# Altium schematic sheet Ethernet SD IO.SchDoc: Ethernet, SD, IO
size A4; Organization: Gadget Sandbox; SheetNumber: 4; SheetTotal: 5; License: CC-BY-SA 3.0; Version: 0.1; Project: NeoCortex Alice
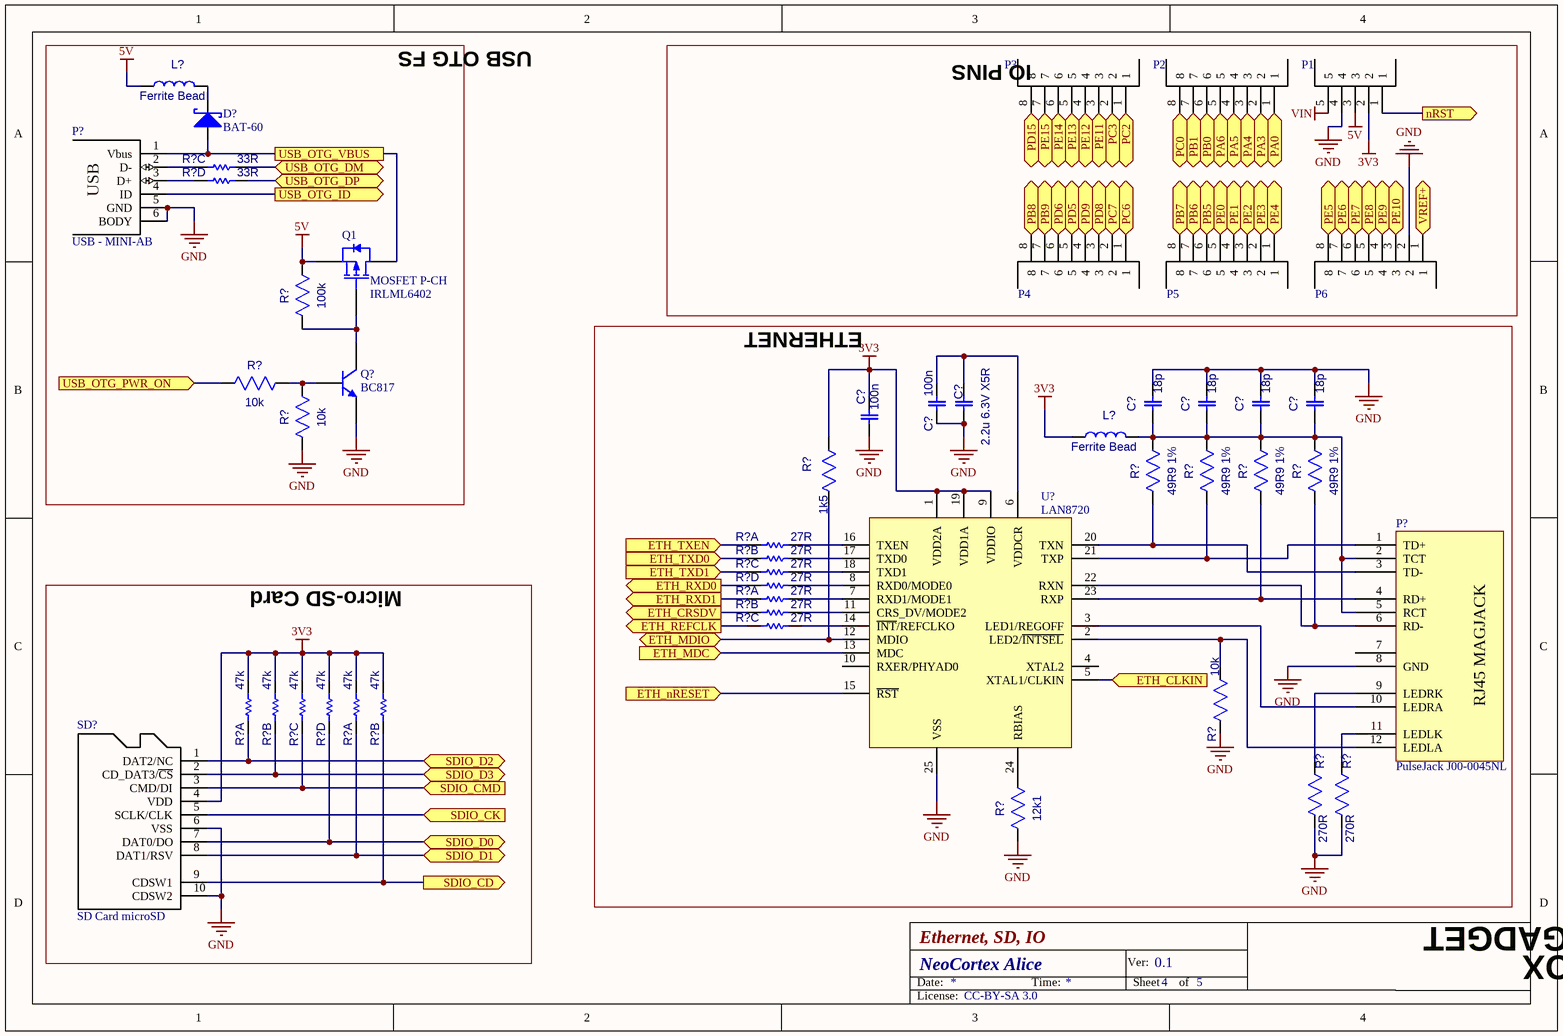
[diagram p0: Ethernet SD IO.SchDoc]

## Parts
(Parts that share a designator on the sheet are numbered #1, #2 ... from top to bottom, then left to right.)
C?#1  2.2u 6.3V X5R  [CAP 0603]
C?#2  100n  [CAP 0805]
C?#3  18p  [CAP 0603]
C?#4  18p  [CAP 0603]
C?#5  18p  [CAP 0603]
C?#6  18p  [CAP 0603]
C?#7  100n  [CAP 0603]
D?  BAT-60  [SOD-323]
L?#1  Ferrite Bead  [IND 0603]
L?#2  Ferrite Bead  [IND 0603]
P1  CONN - 5W  [Header Female 05 2.54]  (value not drawn)
P2  CONN - 8W  [TERM-PL-8 3.81]  (value not drawn)
P3  CONN - 8W  [TERM-PL-8 3.81]  (value not drawn)
P4  CONN - 8W  [TERM-PL-8 3.81]  (value not drawn)
P5  CONN - 8W  [TERM-PL-8 3.81]  (value not drawn)
P6  CONN - 8W  [TERM-PL-8 3.81]  (value not drawn)
P?#1  USB - MINI-AB  [USB - MINI-AB SMD]
P?#2  PulseJack J00-0045NL  [RJ45 MAGJACK STARJACK]
Q1  MOSFET P-CH  Comp2: IRLML6402  [SOT-23]
Q?  BC817  [SOT-23]
R?#1  33R  [RES ARRAY 0804]  (part C of 4)
R?#2  33R  [RES ARRAY 0804]  (part D of 4)
R?#3  100k  [RES 0603]
R?#4  10k  [RES 0603]
R?#5  10k  [RES 0603]
R?#6  1k5  [RES 0603]
R?#7  49R9 1%  [RES 0603]
R?#8  49R9 1%  [RES 0603]
R?#9  49R9 1%  [RES 0603]
R?#10  49R9 1%  [RES 0603]
R?#11  27R  [RES ARRAY 0804]  (part A of 4)
R?#12  27R  [RES ARRAY 0804]  (part B of 4)
R?#13  27R  [RES ARRAY 0804]  (part C of 4)
R?#14  27R  [RES ARRAY 0804]  (part D of 4)
R?#15  27R  [RES ARRAY 0804]  (part A of 4)
R?#16  27R  [RES ARRAY 0804]  (part B of 4)
R?#17  27R  [RES ARRAY 0804]  (part C of 4)
R?#18  47k  [RES ARRAY 0804]  (part A of 4)
R?#19  47k  [RES ARRAY 0804]  (part B of 4)
R?#20  47k  [RES ARRAY 0804]  (part C of 4)
R?#21  47k  [RES ARRAY 0804]  (part D of 4)
R?#22  47k  [RES ARRAY 0804]  (part A of 4)
R?#23  47k  [RES ARRAY 0804]  (part B of 4)
R?#24  10k  [RES 0603]
R?#25  270R  [RES 0603]
R?#26  270R  [RES 0603]
R?#27  12k1  [RES 0603]
SD?  SD Card microSD  [SD CARD microSD 3]
U?  LAN8720  [QFN-24 (4x4)]

## Blocks framed on the sheet
USB OTG FS: D? L?#1 P?#1 Q1 Q? R?#1-R?#5
IO PINS: P1-P6
ETHERNET: C?#1-C?#7 L?#2 P?#2 R?#6-R?#17 R?#24-R?#27 U?
Micro-SD Card: R?#18-R?#23 SD?

## Ports
ETH_CLKIN (in), ETH_CRSDV (out), ETH_MDC (in), ETH_MDIO (bidir), ETH_nRESET (in), ETH_REFCLK (out), ETH_RXD0 (out), ETH_RXD1 (out), ETH_TXD0 (in), ETH_TXD1 (in), ETH_TXEN (in), nRST (out), PA0 (bidir), PA3 (bidir), PA4 (bidir), PA5 (bidir), PA6 (bidir), PB0 (bidir), PB1 (bidir), PB5 (bidir), PB6 (bidir), PB7 (bidir), PB8 (bidir), PB9 (bidir), PC0 (bidir), PC2 (bidir), PC3 (bidir), PC6 (bidir), PC7 (bidir), PD5 (bidir), PD6 (bidir), PD8 (bidir), PD9 (bidir), PD15 (bidir), PE0 (bidir), PE1 (bidir), PE2 (bidir), PE3 (bidir), PE4 (bidir), PE5 (bidir), PE6 (bidir), PE7 (bidir), PE8 (bidir), PE9 (bidir), PE10 (bidir), PE11 (bidir), PE12 (bidir), PE13 (bidir), PE14 (bidir), PE15 (bidir), SDIO_CD (out), SDIO_CK (in), SDIO_CMD (in), SDIO_D0 (bidir), SDIO_D1 (bidir), SDIO_D2 (bidir), SDIO_D3 (bidir), USB_OTG_DM (bidir), USB_OTG_DP (bidir), USB_OTG_ID (out), USB_OTG_PWR_ON (in), USB_OTG_VBUS, VREF+ (bidir)

## Nets
3V3: C?#7.2 L?#2.1 P1.2 R?#6.1 R?#18.8 R?#19.7 R?#20.6 R?#21.5 R?#22.8 R?#23.7 SD?.4(VDD) U?.1(VDD2A) U?.9(VDDIO) U?.19(VDD1A)
5V: L?#1.1 P1.3 Q1.2(S) R?#3.1
GND: C?#1.2 C?#2.1 C?#3.2 C?#4.2 C?#5.2 C?#6.2 C?#7.1 P1.4 P6.2 P?#1.5(GND) P?#1.6(BODY) P?#2.8(GND) Q?.2(E) R?#5.2 R?#24.2 R?#25.2 R?#26.2 R?#27.2 SD?.6(VSS) SD?.10(CDSW2) U?.25(VSS)
VIN: P1.5
ETH_CLKIN: U?.5(XTAL1/CLKIN) ; port ETH_CLKIN
ETH_CRSDV: R?#16.2 ; port ETH_CRSDV
ETH_MDC: U?.13(MDC) ; port ETH_MDC
ETH_MDIO: R?#6.2 U?.12(MDIO) ; port ETH_MDIO
ETH_nRESET: U?.15(~{RST}) ; port ETH_nRESET
ETH_REFCLK: R?#17.3 ; port ETH_REFCLK
ETH_RXD0: R?#14.4 ; port ETH_RXD0
ETH_RXD1: R?#15.1 ; port ETH_RXD1
ETH_TXD0: R?#12.2 ; port ETH_TXD0
ETH_TXD1: R?#13.3 ; port ETH_TXD1
ETH_TXEN: R?#11.1 ; port ETH_TXEN
nRST: P1.1 ; port nRST
PA0: P2.1 ; port PA0
PA3: P2.2 ; port PA3
PA4: P2.3 ; port PA4
PA5: P2.4 ; port PA5
PA6: P2.5 ; port PA6
PB0: P2.6 ; port PB0
PB1: P2.7 ; port PB1
PB5: P5.6 ; port PB5
PB6: P5.7 ; port PB6
PB7: P5.8 ; port PB7
PB8: P4.8 ; port PB8
PB9: P4.7 ; port PB9
PC0: P2.8 ; port PC0
PC2: P3.1 ; port PC2
PC3: P3.2 ; port PC3
PC6: P4.1 ; port PC6
PC7: P4.2 ; port PC7
PD5: P4.5 ; port PD5
PD6: P4.6 ; port PD6
PD8: P4.3 ; port PD8
PD9: P4.4 ; port PD9
PD15: P3.8 ; port PD15
PE0: P5.5 ; port PE0
PE1: P5.4 ; port PE1
PE2: P5.3 ; port PE2
PE3: P5.2 ; port PE3
PE4: P5.1 ; port PE4
PE5: P6.8 ; port PE5
PE6: P6.7 ; port PE6
PE7: P6.6 ; port PE7
PE8: P6.5 ; port PE8
PE9: P6.4 ; port PE9
PE10: P6.3 ; port PE10
PE11: P3.3 ; port PE11
PE12: P3.4 ; port PE12
PE13: P3.5 ; port PE13
PE14: P3.6 ; port PE14
PE15: P3.7 ; port PE15
SDIO_CD: R?#23.2 SD?.9(CDSW1) ; port SDIO_CD
SDIO_CK: SD?.5(SCLK/CLK) ; port SDIO_CK
SDIO_CMD: R?#20.3 SD?.3(CMD/DI) ; port SDIO_CMD
SDIO_D0: R?#21.4 SD?.7(DAT0/DO) ; port SDIO_D0
SDIO_D1: R?#22.1 SD?.8(DAT1/RSV) ; port SDIO_D1
SDIO_D2: R?#18.1 SD?.1(DAT2/NC) ; port SDIO_D2
SDIO_D3: R?#19.2 SD?.2(CD_DAT3/~{CS}) ; port SDIO_D3
USB_OTG_DM: R?#1.6 ; port USB_OTG_DM
USB_OTG_DP: R?#2.5 ; port USB_OTG_DP
USB_OTG_ID: P?#1.4(ID) ; port USB_OTG_ID
USB_OTG_PWR_ON: R?#4.2 ; port USB_OTG_PWR_ON
USB_OTG_VBUS: D?.1(A) P?#1.1(Vbus) Q1.3(D) ; port USB_OTG_VBUS
VREF+: P6.1 ; port VREF+
NetC?#1_1: C?#1.1 C?#2.2 U?.6(VDDCR)
NetC?#3_1: C?#3.1 C?#4.1 C?#5.1 C?#6.1 L?#2.2 P?#2.2(TCT) P?#2.5(RCT) R?#7.1 R?#8.1 R?#9.1 R?#10.1
NetD?_2: D?.2(K) L?#1.2
NetP?#1_2: P?#1.2(D-) R?#1.3
NetP?#1_3: P?#1.3(D+) R?#2.4
NetP?#2_1: P?#2.1(TD+) R?#8.2 U?.21(TXP)
NetP?#2_3: P?#2.3(TD-) R?#7.2 U?.20(TXN)
NetP?#2_4: P?#2.4(RD+) R?#9.2 U?.23(RXP)
NetP?#2_6: P?#2.6(RD-) R?#10.2 U?.22(RXN)
NetP?#2_9: P?#2.9(LEDRK) R?#25.1
NetP?#2_10: P?#2.10(LEDRA) U?.3(LED1/REGOFF)
NetP?#2_11: P?#2.11(LEDLK) R?#26.1
NetP?#2_12: P?#2.12(LEDLA) R?#24.1 U?.2(LED2/~{INTSEL})
NetQ1_1: Q1.1(G) Q?.3(C) R?#3.2
NetQ?_1: Q?.1(B) R?#4.1 R?#5.1
NetR?#11_8: R?#11.8 U?.16(TXEN)
NetR?#12_7: R?#12.7 U?.17(TXD0)
NetR?#13_6: R?#13.6 U?.18(TXD1)
NetR?#14_5: R?#14.5 U?.8(RXD0/MODE0)
NetR?#15_8: R?#15.8 U?.7(RXD1/MODE1)
NetR?#16_7: R?#16.7 U?.11(CRS_DV/MODE2)
NetR?#17_6: R?#17.6 U?.14(~{INT}/REFCLKO)
NetR?#27_1: R?#27.1 U?.24(RBIAS)

Not connected (* = marked no-connect by the designer): P?#2 7; U? 4(XTAL2) 10(RXER/PHYAD0)

## Notes on the sheet
- Date:
- Time:
- Ver:
- Sheet
- of
- GADGET
- SANDBOX
- License:
- (in symbol USB - MINI-AB) USB

## Library data of the parts
C?#1-C?#7 = Capacitor Ceramic
  C?#1: Value: 2.2u 6.3V X5R
  C?#2 C?#7: Value: 100n
  C?#3-C?#6: Value: 18p
D? = Diode Schottky: Schottky; Value: BAT54-G (SOT-23); DiodesInc: 1N5819 (SOD-123); DiodesInc2: BAT60 (SOD-323)
L?#1 L?#2 = Inductor: Value: Ferrite Bead
P?#1 = USB - MINI-AB: USB OTG MINI-AB
P?#2 = RJ45 MAGJACK: RJ45 Jack with Magnetics; pin to pad: 2>4 3>2 4>3 9>10 10>9; PulseElectronic: PulseJack J00-0045NL
Q1 = MOSFET P-CHANNEL: P-channel MOSFET; Comp1: PMV65XP
Q? = Transistor NPN: NPN Bipolar Transistor; Comp1: BC817
R?#1 R?#2 R?#11-R?#23 = Resistor Array 4w
  R?#1 R?#2: Value: 33R
  R?#11-R?#17: Value: 27R
  R?#18-R?#23: Value: 47k
R?#3-R?#10 R?#24-R?#27 = Resistor
  R?#3: Value: 100k
  R?#4 R?#5 R?#24: Value: 10k
  R?#6: Value: 1k5
  R?#7-R?#10: Value: 49R9 1%
  R?#25 R?#26: Value: 270R
  R?#27: Value: 12k1
U? = LAN8720: RMII 10/100 ethernet interface
P2-P6 = CONN - 8W: Value: *; Name: *